# EAGLE schematic MIDI_Module (EAGLE 7.6.0)

## Sheet 1 of 3
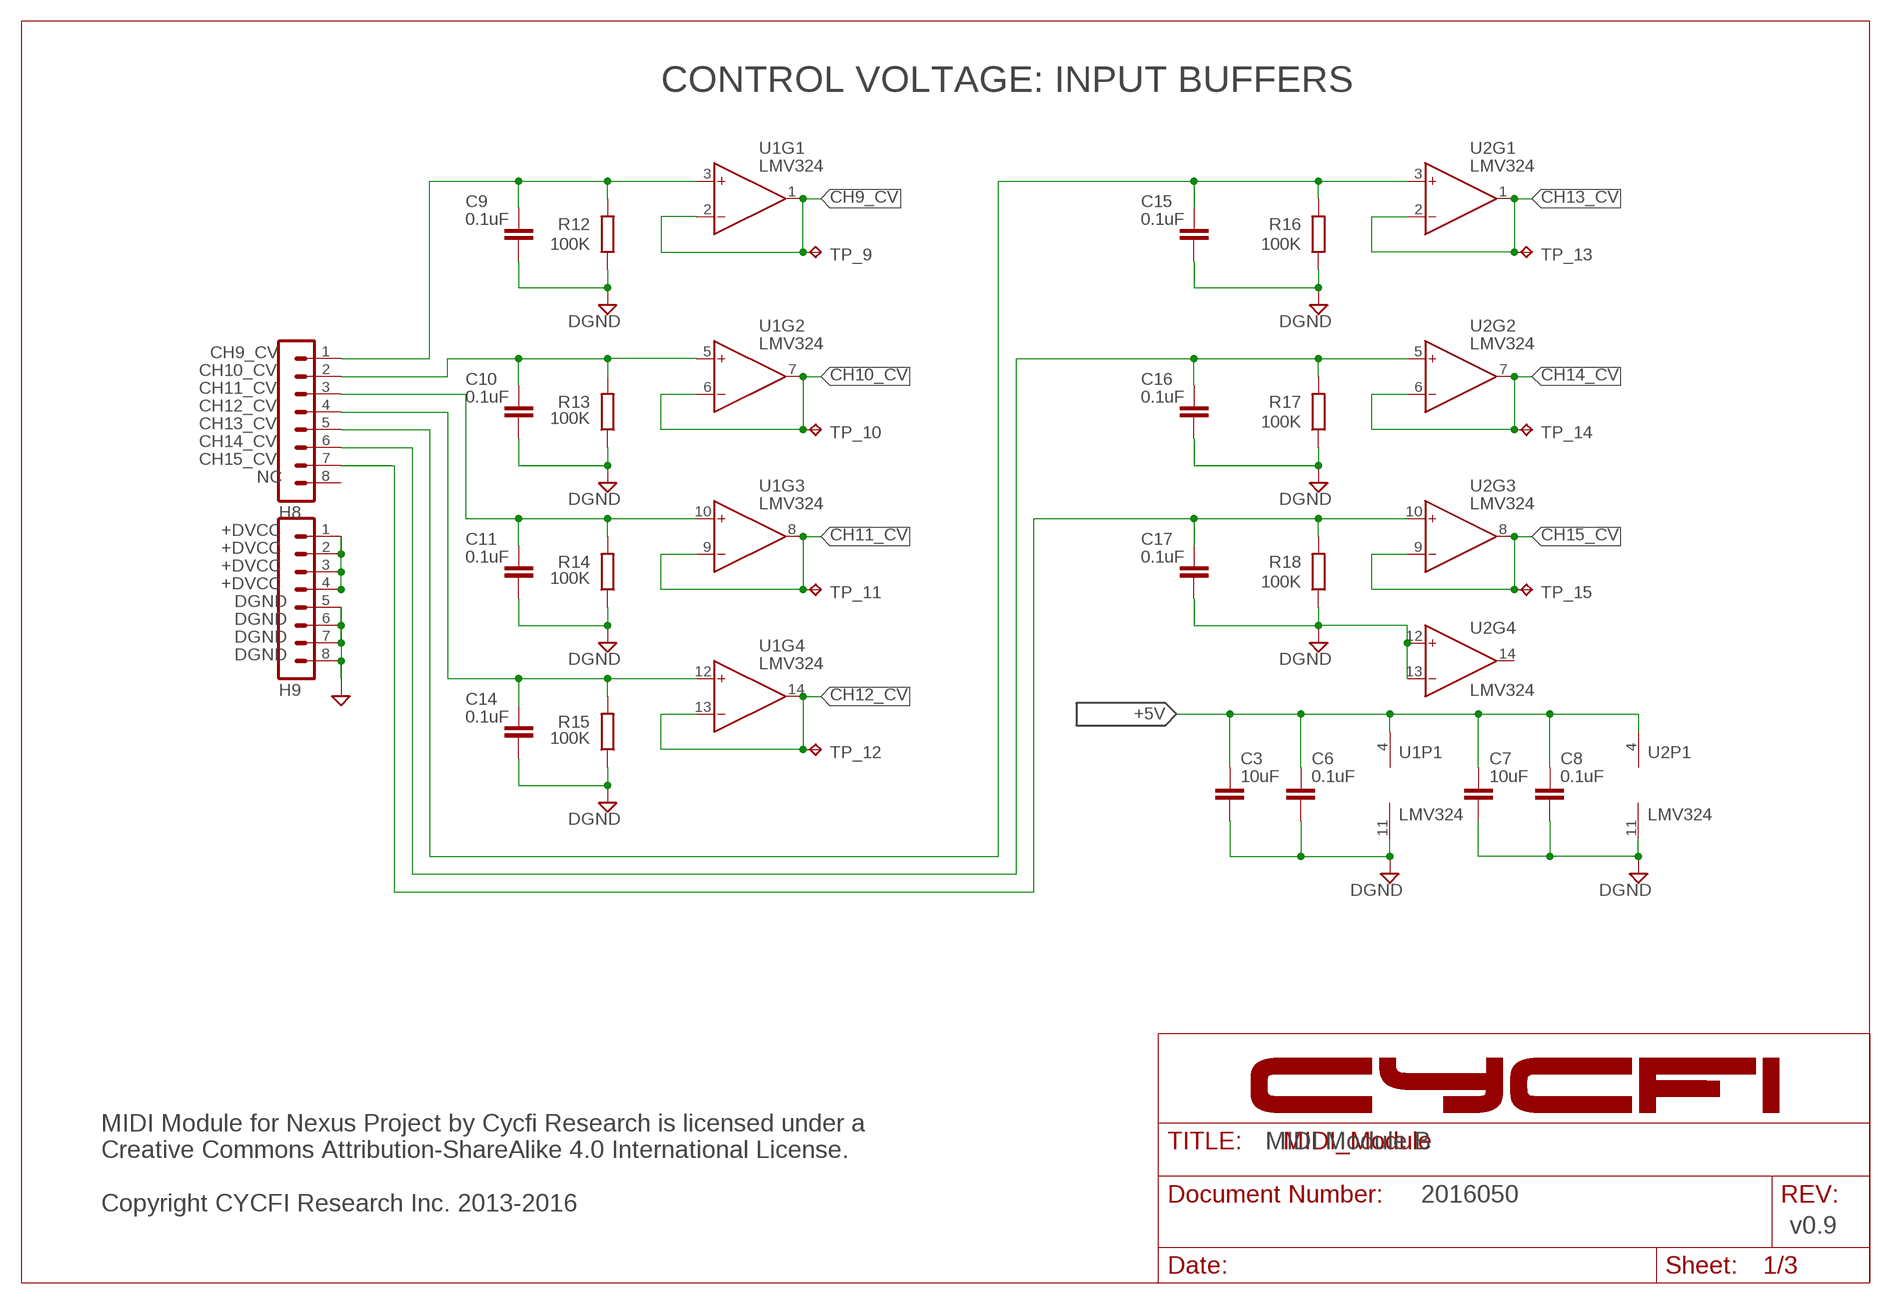
[diagram p0: schematic, sheet 1]

### Parts
C3  10uF  C-EUC0805  [C0805]
C6  0.1uF  C-EUC0603  [C0603]
C7  10uF  C-EUC0805  [C0805]
C8  0.1uF  C-EUC0603  [C0603]
C9  0.1uF  C-EUC0603  [C0603]
C10  0.1uF  C-EUC0603  [C0603]
C11  0.1uF  C-EUC0603  [C0603]
C14  0.1uF  C-EUC0603  [C0603]
C15  0.1uF  C-EUC0603  [C0603]
C16  0.1uF  C-EUC0603  [C0603]
C17  0.1uF  C-EUC0603  [C0603]
H8  MA08-1  [MA08-1]
H9  MA08-1  [MA08-1]
R12  100K  R-EU_R0402  [R0402]
R13  100K  R-EU_R0402  [R0402]
R14  100K  R-EU_R0402  [R0402]
R15  100K  R-EU_R0402  [R0402]
R16  100K  R-EU_R0402  [R0402]
R17  100K  R-EU_R0402  [R0402]
R18  100K  R-EU_R0402  [R0402]
TP_9  TPB1,27  [B1,27]
TP_10  TPB1,27  [B1,27]
TP_11  TPB1,27  [B1,27]
TP_12  TPB1,27  [B1,27]
TP_13  TPB1,27  [B1,27]
TP_14  TPB1,27  [B1,27]
TP_15  TPB1,27  [B1,27]
U1  LMV324  [SSOP-14]
U2  LMV324  [SSOP-14]

### Nets
+5V: C3.1 C6.1 C7.1 C8.1 U1.4(P1:V+) U2.4(P1:V+) ; also sheet 2,3
+DVCC: H9.1 H9.2 H9.3 H9.4 ; also sheet 3
CH9_CV: TP_9.TP U1.1(OUT) U1.2(IN-) ; also sheet 2
CH10_CV: TP_10.TP U1.6(IN-) U1.7(OUT) ; also sheet 2
CH11_CV: TP_11.TP U1.8(OUT) U1.9(IN-) ; also sheet 2
CH12_CV: TP_12.TP U1.13(IN-) U1.14(OUT) ; also sheet 2
CH13_CV: TP_13.TP U2.1(OUT) U2.2(IN-) ; also sheet 2
CH14_CV: TP_14.TP U2.6(IN-) U2.7(OUT) ; also sheet 2
CH15_CV: TP_15.TP U2.8(OUT) U2.9(IN-) ; also sheet 2
DGND: C3.2 C6.2 C7.2 C8.2 C9.2 C10.2 C11.2 C14.2 C15.2 C16.2 C17.2 H9.5 H9.6 H9.7 H9.8 R12.1 R13.1 R14.1 R15.1 R16.1 R17.1 R18.1 U1.11(P1:V-) U2.11(P1:V-) U2.12(IN+) U2.13(IN-) ; also sheet 2
N$4: C9.1 H8.1 R12.2 U1.3(IN+)
N$10: C10.1 H8.2 R13.2 U1.5(IN+)
N$11: C11.1 H8.3 R14.2 U1.10(IN+)
N$14: C14.1 H8.4 R15.2 U1.12(IN+)
N$19: C15.1 H8.5 R16.2 U2.3(IN+)
N$20: C16.1 H8.6 R17.2 U2.5(IN+)
N$21: C17.1 H8.7 R18.2 U2.10(IN+)
Unconnected: H8.8 U2.14(OUT)

### Notes on the sheet
- CONTROL VOLTAGE: INPUT BUFFERS
- CH9_CV
- CH10_CV
- CH11_CV
- CH12_CV
- CH13_CV
- CH14_CV
- CH15_CV
- NC
- DGND
- DGND
- DGND
- MIDI Module B
- 2016050
- MIDI Module for Nexus Project by Cycfi Research is licensed under a 
  Creative Commons Attribution-ShareAlike 4.0 International License.
  
  Copyright CYCFI Research Inc. 2013-2016
- v0.9

## Sheet 2 of 3
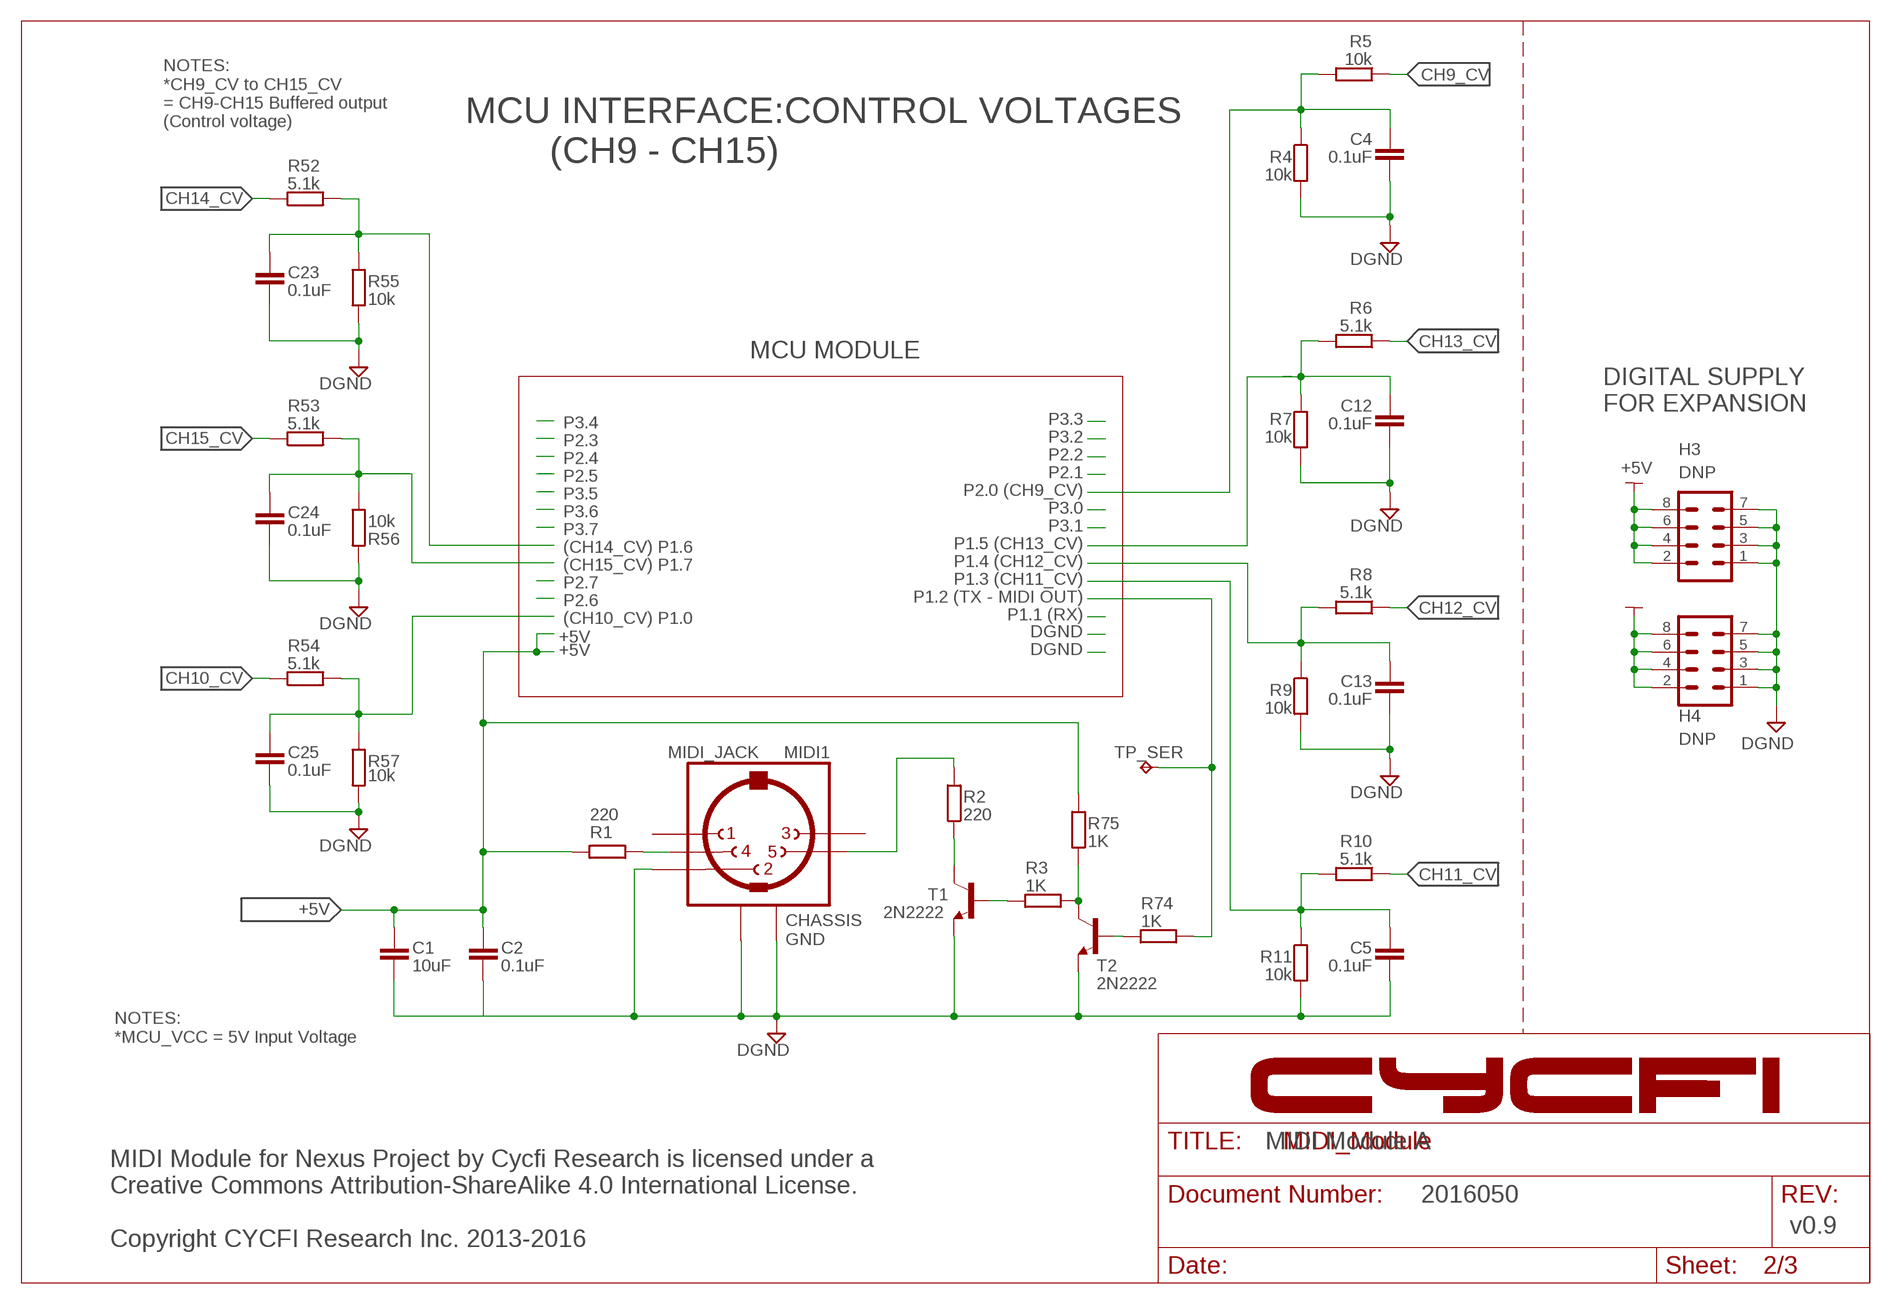
[diagram p1: schematic, sheet 2]

### Parts
C1  10uF  C-EUC0805  [C0805]
C2  0.1uF  C-EUC0603  [C0603]
C4  0.1uF  C-EUC0603  [C0603]
C5  0.1uF  C-EUC0603  [C0603]
C12  0.1uF  C-EUC0603  [C0603]
C13  0.1uF  C-EUC0603  [C0603]
C23  0.1uF  C-EUC0603  [C0603]
C24  0.1uF  C-EUC0603  [C0603]
C25  0.1uF  C-EUC0603  [C0603]
H3  DNP  MA04-2  [MA04-2]
H4  DNP  MA04-2  [MA04-2]
MIDI1  MIDI_JACK  [MIDI_JACK]
R1  220  R-EU_R0402  [R0402]
R2  220  R-EU_R0402  [R0402]
R3  1K  R-EU_R0402  [R0402]
R4  10k  R-EU_R0402  [R0402]
R5  10k  R-EU_R0402  [R0402]
R6  5.1k  R-EU_R0402  [R0402]
R7  10k  R-EU_R0402  [R0402]
R8  5.1k  R-EU_R0402  [R0402]
R9  10k  R-EU_R0402  [R0402]
R10  5.1k  R-EU_R0402  [R0402]
R11  10k  R-EU_R0402  [R0402]
R52  5.1k  R-EU_R0402  [R0402]
R53  5.1k  R-EU_R0402  [R0402]
R54  5.1k  R-EU_R0402  [R0402]
R55  10k  R-EU_R0402  [R0402]
R56  10k  R-EU_R0402  [R0402]
R57  10k  R-EU_R0402  [R0402]
R74  1K  R-EU_R0402  [R0402]
R75  1K  R-EU_R0402  [R0402]
T1  2N2222  TRAN-MMBT2222A  [SOT23-3]
T2  2N2222  TRAN-MMBT2222A  [SOT23-3]
TP_SER  TPB1,27  [B1,27]

### Nets
+3.3V: H4.2 H4.4 H4.6 H4.8 ; also sheet 3
+5V: C1.1 C2.1 H3.2 H3.4 H3.6 H3.8 R1.2 R75.2 ; also sheet 1,3
CH9_CV: R5.1 ; also sheet 1
CH10_CV: R54.1 ; also sheet 1
CH11_CV: R10.1 ; also sheet 1
CH12_CV: R8.1 ; also sheet 1
CH13_CV: R6.1 ; also sheet 1
CH14_CV: R52.1 ; also sheet 1
CH15_CV: R53.1 ; also sheet 1
DGND: C1.2 C2.2 C4.2 C5.2 C12.2 C13.2 C23.2 C24.2 C25.2 H3.1 H3.3 H3.5 H3.7 H4.1 H4.3 H4.5 H4.7 MIDI1.2 MIDI1.G1 MIDI1.G2 R4.2 R7.2 R9.2 R11.2 R55.2 R56.2 R57.2 T1.2(E) T2.2(E) ; also sheet 1
N$1: MIDI1.5 R2.2
N$2: R2.1 T1.3(C)
N$3: R3.2 T1.1(B)
N$5: MIDI1.4 R1.1
N$8: R74.2 T2.1(B)
N$9: R3.1 R75.1 T2.3(C)
P1.0: C25.1 R54.2 R57.1 ; also sheet 3
P1.2: R74.1 TP_SER.TP ; also sheet 3
P1.3: C5.1 R10.2 R11.1 ; also sheet 3
P1.4: C13.1 R8.2 R9.1 ; also sheet 3
P1.5: C12.1 R6.2 R7.1 ; also sheet 3
P1.6: C23.1 R52.2 R55.1 ; also sheet 3
P1.7: C24.1 R53.2 R56.1 ; also sheet 3
P2.0: C4.1 R4.1 R5.2 ; also sheet 3
Unconnected: MIDI1.1 MIDI1.3

### Notes on the sheet
- NOTES:
  *CH9_CV to CH15_CV 
  = CH9-CH15 Buffered output 
  (Control voltage)
- MCU INTERFACE:CONTROL VOLTAGES
          (CH9 - CH15)
- MCU MODULE
- DIGITAL SUPPLY
  FOR EXPANSION
- P3.4
- P3.3
- P2.3
- P3.2
- P2.4
- P2.2
- P2.5
- P2.1
- P3.5
- P2.0 (CH9_CV)
- P3.6
- P3.0
- P3.7
- P3.1
- (CH14_CV) P1.6
- P1.5 (CH13_CV)
- (CH15_CV) P1.7
- P1.4 (CH12_CV)
- P2.7
- P1.3 (CH11_CV)
- P2.6
- P1.2 (TX - MIDI OUT)
- (CH10_CV) P1.0
- P1.1 (RX)
- CHASSIS 
  GND
- NOTES:
  *MCU_VCC = 5V Input Voltage
- MIDI Module A
- 2016050
- v0.9
- MIDI Module for Nexus Project by Cycfi Research is licensed under a
  Creative Commons Attribution-ShareAlike 4.0 International License.
  
  Copyright CYCFI Research Inc. 2013-2016

## Sheet 3 of 3
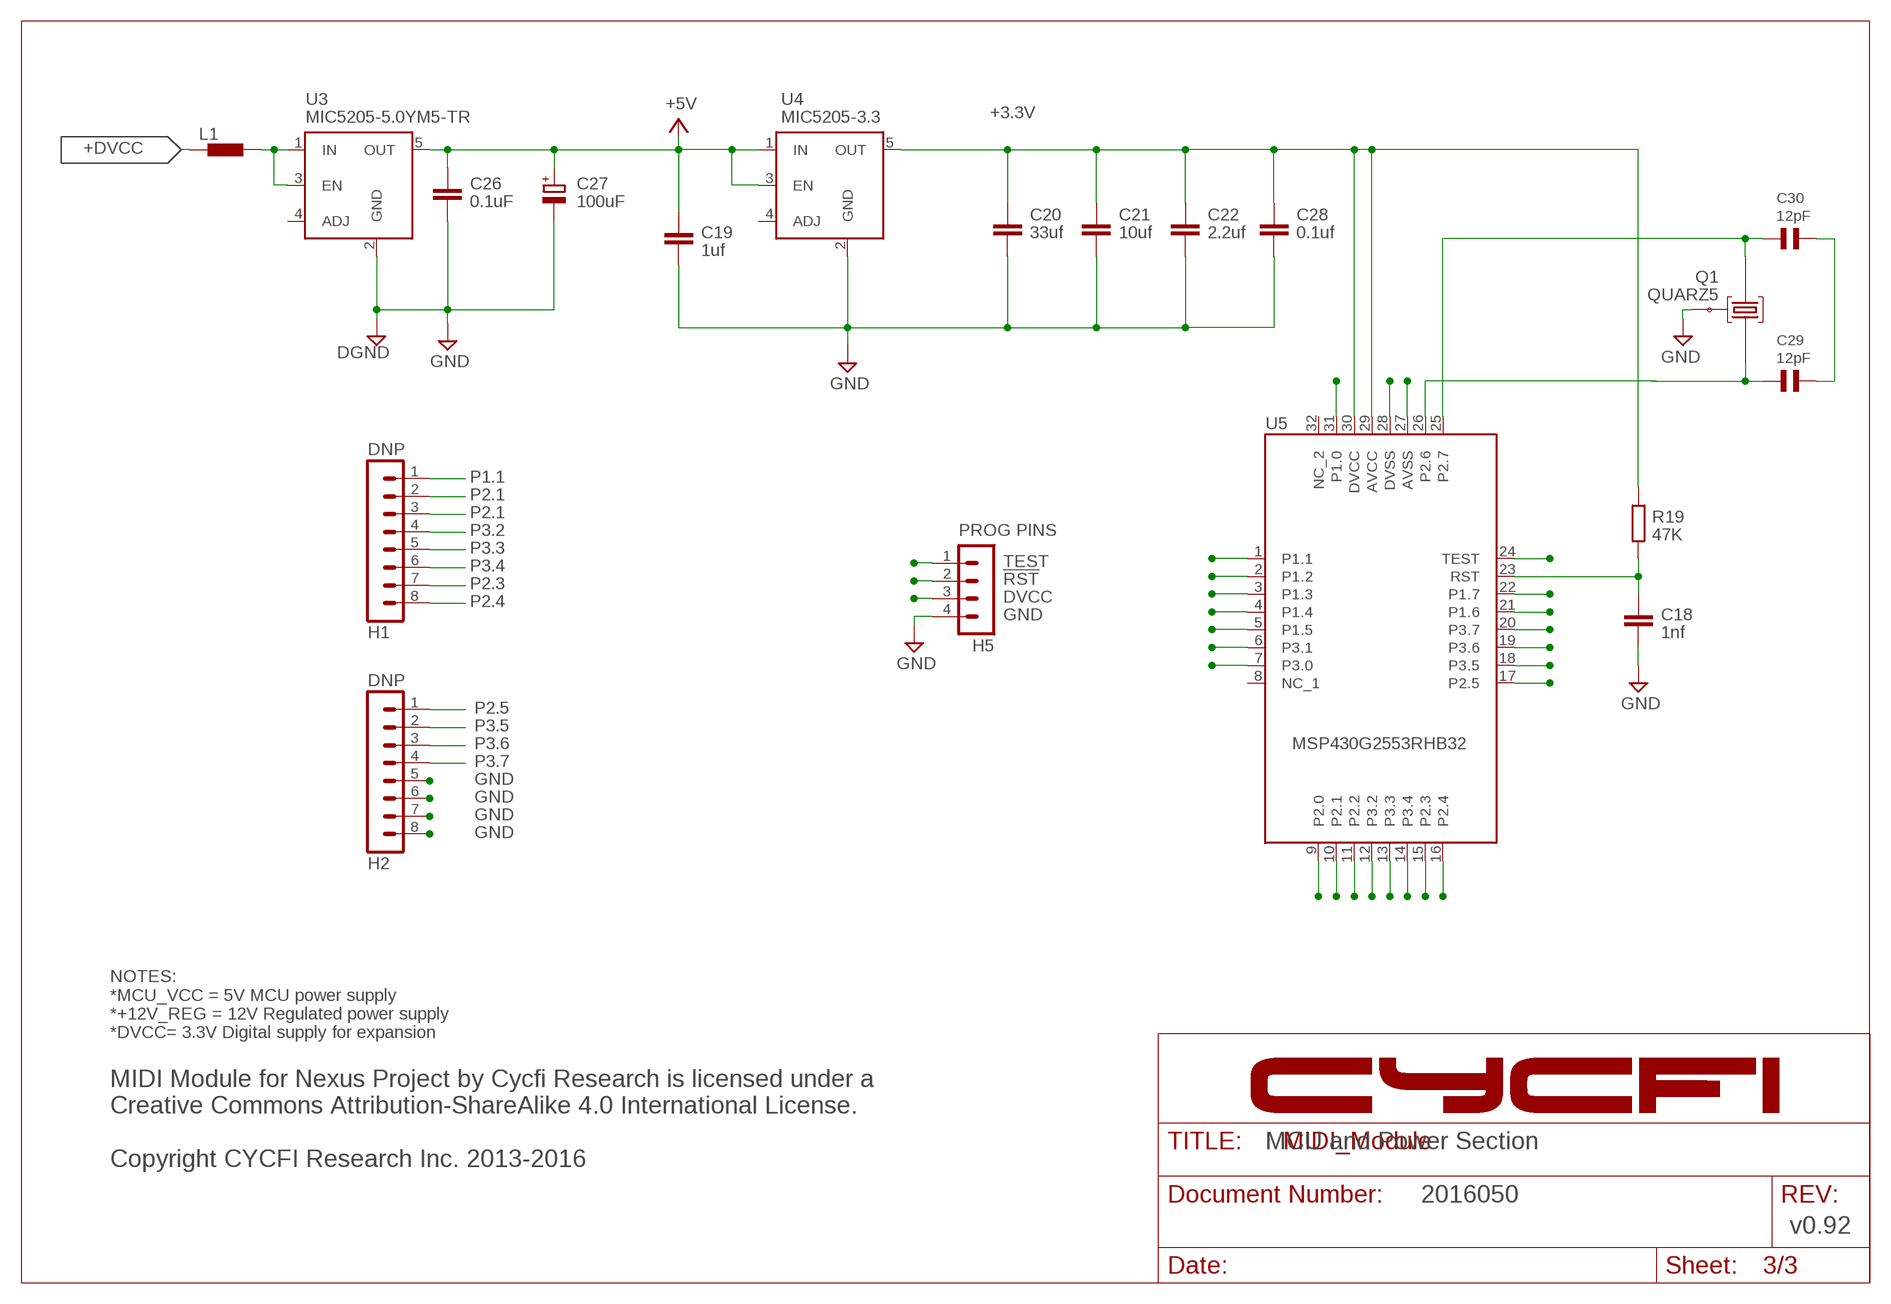
[diagram p2: schematic, sheet 3]

### Parts
C18  1nf  C-EUC0603  [C0603]
C19  1uf  C-EUC0805  [C0805]
C20  33uf  C-EUC0805  [C0805]
C21  10uf  C-EUC0805  [C0805]
C22  2.2uf  C-EUC0805  [C0805]
C26  0.1uF  C-EUC0603  [C0603]
C27  100uF  CPOL-EU153CLV-0505  [153CLV-0505]
C28  0.1uf  C-EUC0603  [C0603]
C29  12pF  C_SMD0603  [0603]
C30  12pF  C_SMD0603  [0603]
H1  DNP  MA08-1  [MA08-1]
H2  DNP  MA08-1  [MA08-1]
H5  MA04-1  [MA04-1]
L1  BLM15HB121SN1  [0402]
Q1  QUARZ5  [QUARZ5]
R19  47K  R-EU_R0402  [R0402]
U3  MIC5205-5.0YM5-TR  MIC5219BM5  [SOT23-5]
U4  MIC5205-3.3  MIC5219BM5  [SOT23-5]
U5  MSP430G2553RHB32  [QFN32]

### Nets
!RST: C18.1 R19.2 U5.23(RST)
!RST1: H5.2
+3.3V: C20.1 C21.1 C22.1 C28.1 R19.1 U4.5(OUT) U5.29(AVCC) U5.30(DVCC) ; also sheet 2
+5V: C19.1 C26.1 C27.+ U3.5(OUT) U4.1(IN) U4.3(EN) ; supply symbol labelled VCC ; also sheet 1,2
+DVCC: L1.1 ; also sheet 1
DVCC(3.3V): H5.3
GND: C18.2 C19.2 C20.2 C21.2 C22.2 C26.2 C27.- C28.2 C29.1 C30.1 H2.5 H2.6 H2.7 H2.8 H5.4 Q1.GND@0 U3.2(GND) U4.2(GND) U5.27(AVSS) U5.28(DVSS) ; supply symbol labelled DGND
N$12: L1.2 U3.1(IN) U3.3(EN)
P1.0: U5.31(P1.0) ; also sheet 2
P1.1: H1.1 ; also sheet 2
P1.2: U5.1(P1.1) ; also sheet 2
P1.3: U5.2(P1.2) ; also sheet 2
P1.4: U5.3(P1.3) ; also sheet 2
P1.5: U5.4(P1.4) ; also sheet 2
P1.6: U5.5(P1.5) ; also sheet 2
P1.7: U5.21(P1.6) ; also sheet 2
P1.8: U5.22(P1.7)
P2.0: U5.9(P2.0) ; also sheet 2
P2.1: H1.2 H1.3 ; also sheet 2
P2.3: H1.7 ; also sheet 2
P2.4: H1.8 ; also sheet 2
P2.5: H2.1 ; also sheet 2
P2.8: U5.10(P2.1)
P2.9: U5.11(P2.2)
P2.10: U5.15(P2.3)
P2.11: U5.16(P2.4)
P2.12: U5.17(P2.5)
P2.13: C29.2 Q1.1 U5.26(P2.6)
P2.14: C30.2 Q1.2 U5.25(P2.7)
P3.2: H1.4 ; also sheet 2
P3.3: H1.5 ; also sheet 2
P3.4: H1.6 ; also sheet 2
P3.5: H2.2 ; also sheet 2
P3.6: H2.3 ; also sheet 2
P3.7: H2.4 ; also sheet 2
P3.8: U5.6(P3.1)
P3.9: U5.7(P3.0)
P3.10: U5.20(P3.7)
P3.11: U5.19(P3.6)
P3.12: U5.18(P3.5)
P3.13: U5.12(P3.2)
P3.14: U5.13(P3.3)
P3.15: U5.14(P3.4)
TEST: U5.24(TEST)
TEST1: H5.1
Unconnected: U3.4(ADJ) U4.4(ADJ) U5.8(NC_1)

### Notes on the sheet
- PROG PINS
- TEST
- !RST
- DVCC
- GND
- NOTES:
  *MCU_VCC = 5V MCU power supply
  *+12V_REG = 12V Regulated power supply
  *DVCC= 3.3V Digital supply for expansion
- MCU and Power Section
- MIDI Module for Nexus Project by Cycfi Research is licensed under a 
  Creative Commons Attribution-ShareAlike 4.0 International License.
  
  Copyright CYCFI Research Inc. 2013-2016
- 2016050
- v0.92

## Power pins joined to a net without a drawn wire
NC_2: U5.32(NC_2)

## Library data of the parts
C1-C26 C28 = resistor:C-EU: CAPACITOR, European symbol
C27 = resistor:CPOL-EU: POLARIZED CAPACITOR, European symbol
C29 C30 = ssmd:C_SMD
H1 H2 H8 H9 = con-lstb:MA08-1: PIN HEADER; OC_FARNELL: unknown; OC_NEWARK: unknown
H3 H4 = con-lstb:MA04-2: PIN HEADER; OC_FARNELL: unknown; OC_NEWARK: unknown
H5 = con-lstb:MA04-1: PIN HEADER; OC_FARNELL: unknown; OC_NEWARK: unknown
L1 = inductors:BLM15H: EMIFIL (R) Chip Ferrite Bead for GHz Noise Source: http://www.murata.com/ Ferrite Bead BLM15H.pdf
MIDI1 = CYCFI_Con:MIDI_JACK
Q1 = sMSP430:QUARZ5
R1-R19 R52-R57 R74 R75 = resistor:R-EU_: RESISTOR, European symbol
T1 T2 = Cycfi:TRAN-MMBT2222A
TP_9-TP_15 TP_SER = testpad:TP: Test pad
U1 U2 = CYCFI_semicon:LMV324
U3 U4 = v-reg-micrel:MIC5219BM5: VOLTAGE REGULATOR; MF: ALTERA CORPORATION; MPN: MIC5219BM5 TR; OC_FARNELL: 1100656; OC_NEWARK: 09J8939
U5 = CYCFI_IC:MSP430G2553RHB32